# EAGLE design LB_SMD (EAGLE 6.2)
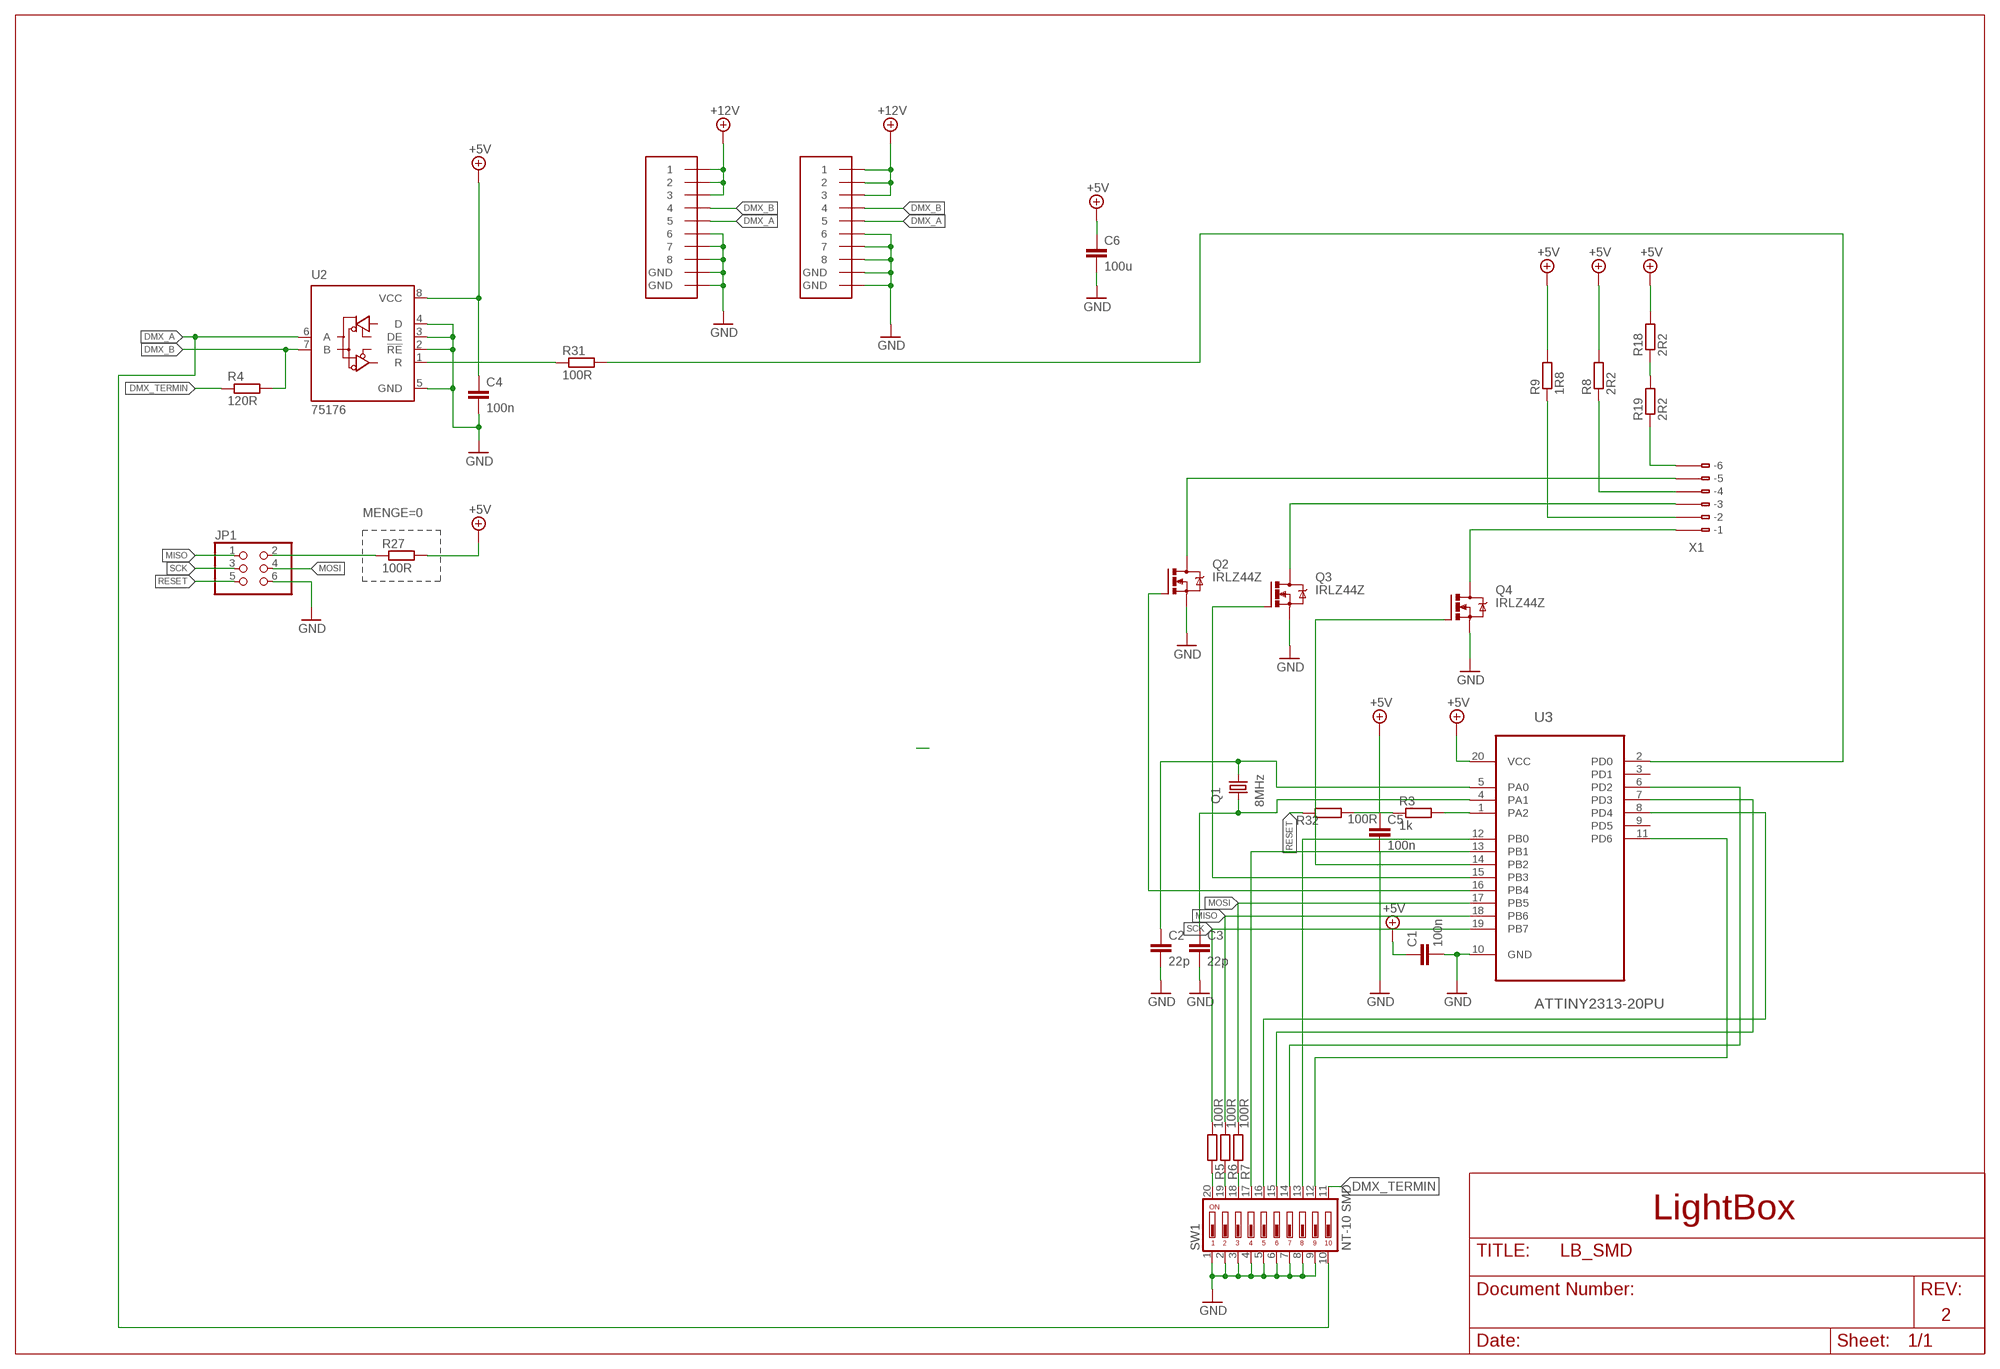
[diagram p0: schematic, sheet 1]

## Parts
C1  100n  C-EUC0805  [C0805]
C2  22p  C-EUC0805  [C0805]
C3  22p  C-EUC0805  [C0805]
C4  100n  C-EUC0805  [C0805]
C5  100n  C-EUC0805  [C0805]
C6  100u  C-EUC0805  [C0805]
JP1  PINHD-2X3  [2X03]
Q1  8MHz  CRYSTALHC49S  [HC49/S]
Q2  IRLZ44Z  [TO220BH]
Q3  IRLZ44Z  [TO220BH]
Q4  IRLZ44Z  [TO220BH]
R3  1k  R-EU_R0805  [R0805]
R4  120R  R-EU_R0805  [R0805]
R5  100R  R-EU_R0805  [R0805]
R6  100R  R-EU_R0805  [R0805]
R7  100R  R-EU_R0805  [R0805]
R8  2R2  R-EU_0207/7  [0207/7]
R9  1R8  R-EU_0207/7  [0207/7]
R18  2R2  R-EU_0207/7  [0207/7]
R19  2R2  R-EU_0207/7  [0207/7]
R27  100R  R-EU_R1206  [R1206]
R31  100R  R-EU_R0805  [R0805]
R32  100R  R-EU_R0805  [R0805]
SW1  NT-10 SMD  219-10  [CTS-219-10]
U2  75176  75176AD  [D_R-PDSO-G8]
U3  ATTINY2313-20PU  [DIP254P762X533-20]
U$1  MEBP8-8G  [RJ45-REICHELT]
U$2  MEBP8-8G  [RJ45-REICHELT]
X1  233-506  [233-506]

## Nets
+5V: C1.1 C4.1 C6.1 R3.1 R8.2 R9.2 R18.2 R27.2 U2.8(VCC) U3.20(VCC)
+12V: U$1.1 U$1.2 U$1.3 U$2.1 U$2.2 U$2.3
DMX_A: SW1.10 U2.6(A) U$1.5 U$2.5
DMX_B: R4.2 U2.7(B) U$1.4 U$2.4
DMX_TERMIN: R4.1 SW1.11
GND: C1.2 C2.2 C3.2 C4.2 C5.2 C6.2 JP1.6 Q2.S Q3.S Q4.S SW1.1 SW1.2 SW1.3 SW1.4 SW1.5 SW1.6 SW1.7 SW1.8 SW1.9 U2.2(!RE) U2.3(DE) U2.4(D) U2.5(GND) U3.10(GND) U$1.6 U$1.7 U$1.8 U$1.GND@1(GND) U$1.GND@2(GND) U$2.6 U$2.7 U$2.8 U$2.GND@1(GND) U$2.GND@2(GND)
MISO: JP1.1 R6.2 U3.18(PB6)
MOSI: JP1.4 R7.2 U3.17(PB5)
N$2: R3.2 U3.1(PA2)
N$3: SW1.12 U3.11(PD6)
N$4: SW1.13 U3.12(PB0)
N$5: R31.1 U2.1(R)
N$6: C5.1 R32.2
N$7: JP1.2 R27.1
N$8: R5.1 SW1.20
N$9: R6.1 SW1.19
N$10: R7.1 SW1.18
N$11: Q3.G U3.15(PB3)
N$12: R18.1 R19.2
N$13: SW1.17 U3.13(PB1)
N$14: SW1.16 U3.8(PD4)
N$15: SW1.15 U3.7(PD3)
N$16: SW1.14 U3.6(PD2)
N$17: U3.2(PD0)
N$19: Q4.G U3.14(PB2)
N$20: Q4.D X1.B1(B-1)
N$21: Q3.D X1.B3(B-3)
N$22: Q2.D X1.B5(B-5)
N$23: R19.1 X1.B6(B-6)
N$24: R8.1 X1.B4(B-4)
N$25: R9.1 X1.B2(B-2)
N$26: Q2.G U3.16(PB4)
N$27: C2.1 Q1.1 U3.5(PA0)
N$29: C3.1 Q1.2 U3.4(PA1)
RESET: JP1.5 R32.1
SCK: JP1.3 R5.2 U3.19(PB7)
Unconnected: R31.2 U3.3(PD1) U3.9(PD5) X1.A1(-1) X1.A2(-2) X1.A3(-3) X1.A4(-4) X1.A5(-5) X1.A6(-6)

## Notes on the sheet
- MENGE=0
- LightBox
- 2

## Library data of the parts
C1-C6 = rcl:C-EU: CAPACITOR, European symbol
JP1 = pinhead:PINHD-2X3: PIN HEADER
Q1 = crystal:CRYSTAL: CRYSTAL; OC_FARNELL: 1667008; OC_NEWARK: unknown
Q2-Q4 = transistor-power:IRLZ44Z: N-Channel HEXFET® Power MOSFET Logic Level AUTOMOTIVE MOSFET Source: http://www.irf.com/product-info/datasheets/data/irlz44zpbf.pdf
R3-R9 R18 R19 R27 R31 R32 = rcl:R-EU_: RESISTOR, European symbol
SW1 = switch-dil:219-10*: Surface Mount DIP Switch Series 219 SMT CTS Electronic Components Sourc: www.ctscorp.com; MF: SLI (CML/IDI); MPN: 219-10PK; OC_FARNELL: unknown; OC_NEWARK: 19M0224
U2 = LB:75176A: DIFFERENTIAL BUS TRANSCEIVER Source: http://focus.ti.com/lit/ds/symlink/sn75176a.pdf
U3 = lightbox:ATTINY2313-20PU: Microcontroller; MPN: ATTINY2313-20PU; OC_FARNELL: 9171592; OC_NEWARK: 96K6525; PACKAGE: DIP-20; SUPPLIER: ATMEL
U$1 U$2 = Reichelt:MEBP8-8G
X1 = con-wago:233-506: WAGO Cage Clamp; MF: Wago Corporation; MPN: 0233-0506; OC_FARNELL: 1777100; OC_NEWARK: 79K2052

## Board
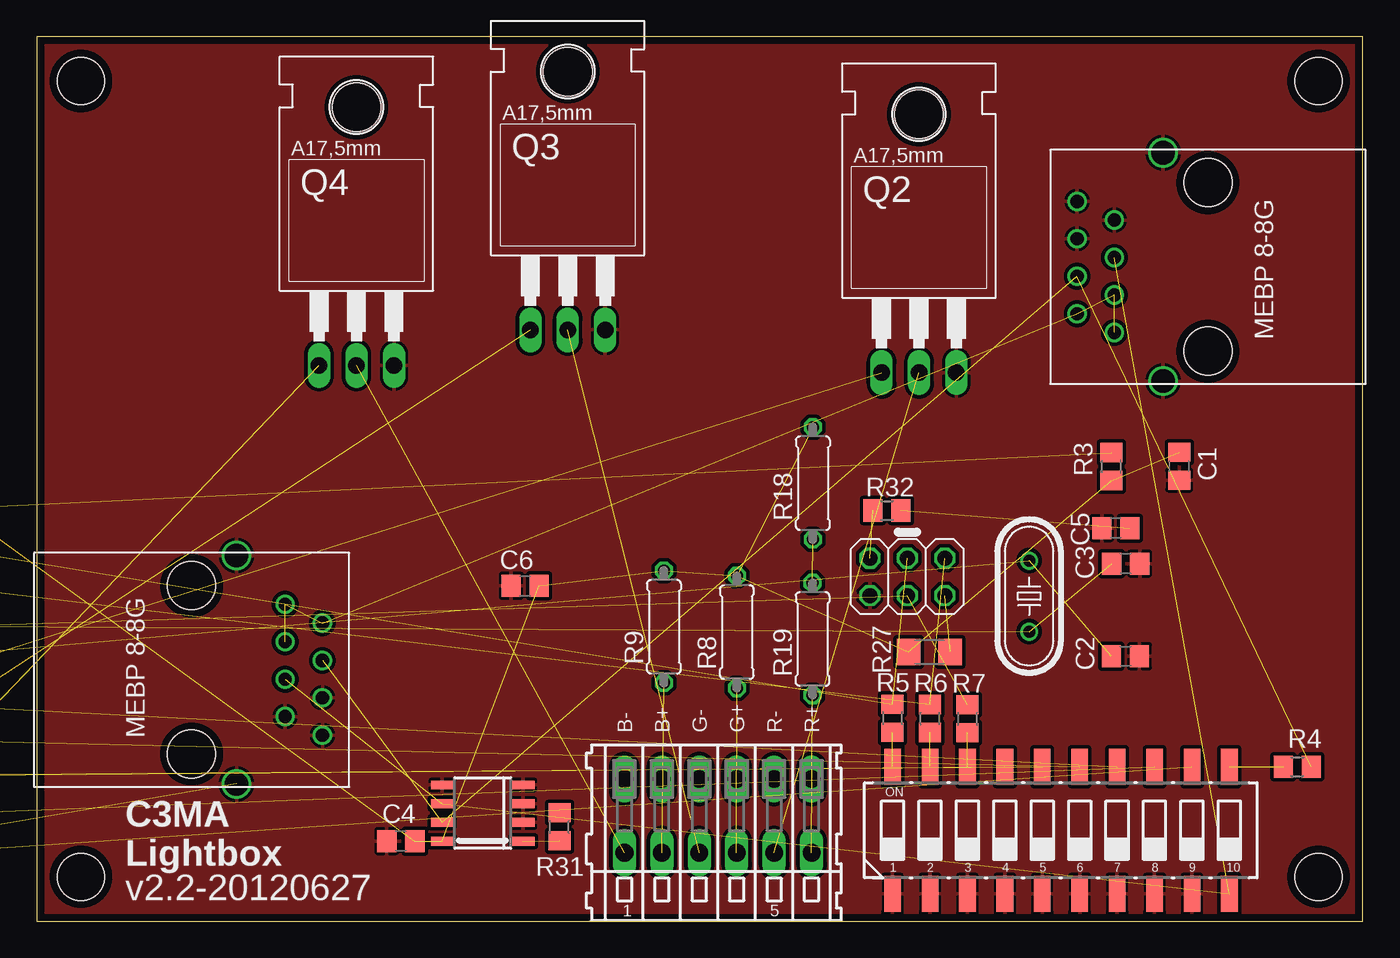
[diagram p1: board, top side]
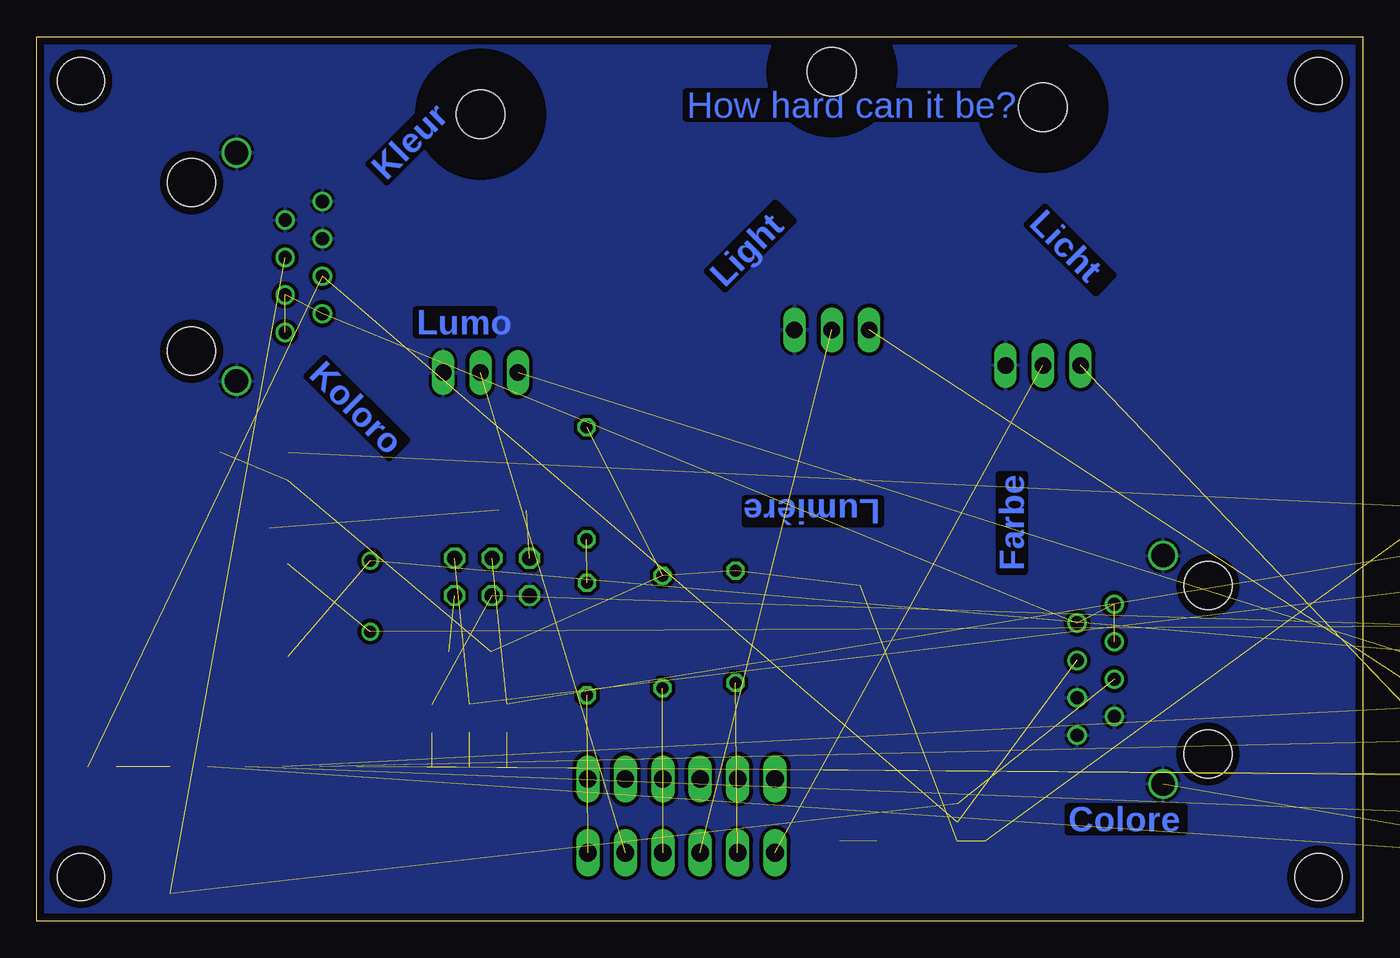
[diagram p2: board, bottom side, seen from below]

Size 90 x 60 mm. Coordinates in mm from the lower left corner, seen from the top.
Outline: 0,0 90,0 90,60 0,60 0,0
Copper layers (1*16): Top 0.035mm / dielectric 1.5mm / Bottom 0.035mm
Design rules: minimum track width 6mil, minimum drill 0.3mm, track to track 6mil, track to pad 6mil, pad to pad 6mil, via to via 6mil, smd to smd 6mil, copper to edge 20mil, drill to drill 10mil, minimum pad ring 8mil, minimum via ring 6mil, stop-mask expansion 3mil, vias tented up to drill 0mil, thermal gap 8mil
Holes 3.2 mm at 3,57 87,3 87,57 3,3

### Footprints (pad centres in the part's own frame; a part is rotated, then mirrored left to right if it is on the bottom)
C0805 = smd 1.3 x 1.5: 1 -0.95,0; 2 0.95,0
2X03 = drill 1.016 octagon: 1 -2.54,-1.27; 2 -2.54,1.27; 3 0,-1.27; 4 0,1.27; 5 2.54,-1.27; 6 2.54,1.27
HC49/S = drill 0.813: 1 -2.413,0; 2 2.413,0
TO220BH = drill 1.118 long: D 0,-6.35; G -2.54,-6.35; S 2.54,-6.35 | hole 3.302: 0,11.176
R0805 = smd 1.3 x 1.5: 1 -0.95,0; 2 0.95,0
0207/7 = drill 0.813 octagon: 1 -3.81,0; 2 3.81,0
R1206 = smd 1.6 x 1.803: 1 -1.422,0; 2 1.422,0
CTS-219-10 = smd 1.13 x 2.44: 1 -11.43,-4.3; 2 -8.89,-4.3; 3 -6.35,-4.3; 4 -3.81,-4.3; 5 -1.27,-4.3; 6 1.27,-4.3; 7 3.81,-4.3; 8 6.35,-4.3; 9 8.89,-4.3; 10 11.43,-4.3; 11 11.43,4.3; 12 8.89,4.3; 13 6.35,4.3; 14 3.81,4.3; 15 1.27,4.3; 16 -1.27,4.3; 17 -3.81,4.3; 18 -6.35,4.3; 19 -8.89,4.3; 20 -11.43,4.3
D_R-PDSO-G8 = smd 0.6 x 1.5: 1 -1.905,-2.75; 2 -0.635,-2.75; 3 0.635,-2.75; 4 1.905,-2.75; 5 1.905,2.75; 6 0.635,2.75; 7 -0.635,2.75; 8 -1.905,2.75
DIP254P762X533-20 = drill 1.118 square: 1 -7.62,22.86 | drill 1.118: 2 -7.62,20.32; 3 -7.62,17.78; 4 -7.62,15.24; 5 -7.62,12.7; 6 -7.62,10.16; 7 -7.62,7.62; 8 -7.62,5.08; 9 -7.62,2.54; 10 -7.62,0; 11 0,0; 12 0,2.54; 13 0,5.08; 14 0,7.62; 15 0,10.16; 16 0,12.7; 17 0,15.24; 18 0,17.78; 19 0,20.32; 20 0,22.86
RJ45-REICHELT = drill 0.9: 1 -4.445,6.35; 2 -3.175,8.89; 3 -1.905,6.35; 4 -0.635,8.89; 5 0.635,6.35; 6 1.905,8.89; 7 3.175,6.35; 8 4.445,8.89 | drill 1.6: GND@1 -7.745,3.05; GND@2 7.745,3.05 | hole 3.25: -5.715,0; 5.715,0
233-506 = drill 1.2 long: A1 -6.35,2.5; A2 -3.81,2.5; A3 -1.27,2.5; A4 1.27,2.5; A5 3.81,2.5; A6 6.35,2.5; B1 -6.35,-2.5; B2 -3.81,-2.5; B3 -1.27,-2.5; B4 1.27,-2.5; B5 3.81,-2.5; B6 6.35,-2.5

### Placement (x,y rotation side)
C1  77.55,30.87 270 top
C2  73.9,17.97 0 top
C3  73.91,24.25 0 top
C4  24.71,5.42 180 top
C5  73.24,26.66 180 top
C6  33.15,22.75 180 top
JP1  59.09,23.36 180 top
Q1  67.36,22.05 270 top
Q2  59.88,43.57 0 top
Q3  36.04,46.46 0 top
Q4  21.7,44.05 0 top
R3  72.94,30.84 90 top
R4  85.56,10.47 0 top
R5  58.09,13.76 90 top
R6  60.63,13.75 90 top
R7  63.18,13.73 90 top
R8  47.52,19.61 90 top
R9  42.57,19.97 90 top
R18  52.68,29.71 90 top
R19  52.66,19.14 90 top
R27  60.59,18.26 180 top
R31  35.47,6.39 90 top
R32  57.71,27.86 0 top
SW1  69.52,6.16 0 top
U2  30.27,7.33 90 top
U3  -5,4.8 0 top  (outside the outline)
U$1  10.5,17.05 270 top
U$2  79.5,44.39 90 top
X1  46.24,7.14 0 top

### Tracks (layer width: path | path; a pad name or v marks a point on that pad's centre or on a via)
+5V  (9 unrouted)
+12V  (5 unrouted)
DMX_A  (3 unrouted)
DMX_B  (3 unrouted)
DMX_TERMIN  (1 unrouted)
GND  (1 unrouted)
  pour Top (isolate 0.254): 0,0 90,0 90,60 0,60
  pour Bottom (isolate 0.254): 0,60 90,60 90,0 0,0
MISO  (2 unrouted)
MOSI  (2 unrouted)
N$2  (1 unrouted)
N$3  (1 unrouted)
N$4  (1 unrouted)
N$5  (1 unrouted)
N$6  (1 unrouted)
N$7  (1 unrouted)
N$8  (1 unrouted)
N$9  (1 unrouted)
N$10  (1 unrouted)
N$11  (1 unrouted)
N$12  (1 unrouted)
N$13  (1 unrouted)
N$14  (1 unrouted)
N$15  (1 unrouted)
N$16  (1 unrouted)
N$19  (1 unrouted)
N$20  (1 unrouted)
N$21  (1 unrouted)
N$22  (1 unrouted)
N$23  (1 unrouted)
N$24  (1 unrouted)
N$25  (1 unrouted)
N$26  (1 unrouted)
N$27  (2 unrouted)
N$29  (2 unrouted)
RESET  (1 unrouted)
SCK  (2 unrouted)

### Text on the board
Bottom: How hard can it be? | Kleur | Licht | Light | Lumo | Koloro | Farbe | Lumière | Colore
tPlace: B- | B+ | G- | G+ | R- | R+ | C3MA | Lightbox | v2.2-20120627